# Altium project Weather_Project.PrjPcb
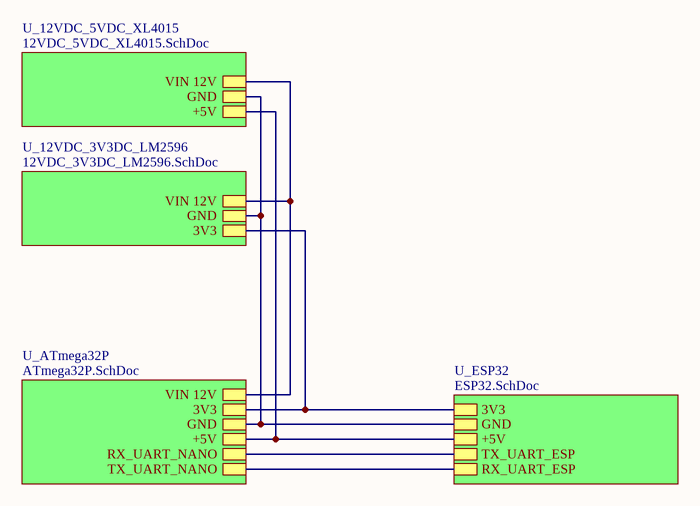
[diagram p0: Merg_project.SchDoc]
4 sheets, 53 parts. Net scope: hierarchical (ports join the sheet entries above them; power ports are global).
Board file: Weather_SIM_PCB.PcbDoc
Sheets:
  Merg_project.SchDoc
    U_12VDC_3V3DC_LM2596 = 12VDC_3V3DC_LM2596.SchDoc
    U_12VDC_5VDC_XL4015 = 12VDC_5VDC_XL4015.SchDoc
    U_ESP32 = ESP32.SchDoc

## Sheet Merg_project.SchDoc
size A; SheetNumber: 1; SheetTotal: 5

### Sub-sheets
U_12VDC_3V3DC_LM2596 = 12VDC_3V3DC_LM2596.SchDoc: 3V3, GND, VIN 12V
U_12VDC_5VDC_XL4015 = 12VDC_5VDC_XL4015.SchDoc: +5V, GND, VIN 12V
U_ATmega32P = ATmega32P.SchDoc (file not in this document): TX_UART_NANO, RX_UART_NANO, +5V, GND, 3V3, VIN 12V
U_ESP32 = ESP32.SchDoc: 3V3, GND, +5V, TX_UART_ESP, RX_UART_ESP

### Nets
3V3: sheet U_12VDC_3V3DC_LM2596/3V3, sheet U_ATmega32P/3V3, sheet U_ESP32/3V3
+5V: sheet U_12VDC_5VDC_XL4015/+5V, sheet U_ATmega32P/+5V, sheet U_ESP32/+5V
GND: sheet U_12VDC_3V3DC_LM2596/GND, sheet U_12VDC_5VDC_XL4015/GND, sheet U_ATmega32P/GND, sheet U_ESP32/GND
IO21: sheet U_ATmega32P/TX_UART_NANO, sheet U_ESP32/RX_UART_ESP
IO22: sheet U_ATmega32P/RX_UART_NANO, sheet U_ESP32/TX_UART_ESP
VIN: sheet U_12VDC_3V3DC_LM2596/VIN 12V, sheet U_12VDC_5VDC_XL4015/VIN 12V, sheet U_ATmega32P/VIN 12V

## Sheet 12VDC_3V3DC_LM2596.SchDoc
size 381 x 241 mm; SheetNumber: 3; SheetTotal: 5
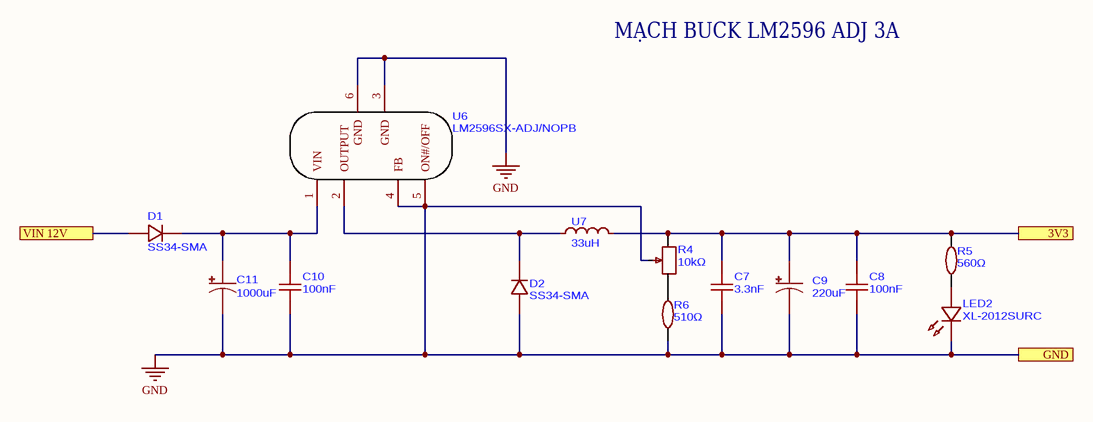
[diagram p1: 12VDC_3V3DC_LM2596.SchDoc]

### Parts
C7  3.3nF  [C0805]
C8  100nF  [C0805]
C9  220uF  [CAP-SMD_BD10.0-L10.3-W10.3-LS11.0-R-RD]
C10  100nF  [C0805]
C11  1000uF  [CAP-SMD_BD10.0-L10.3-W10.3-LS11.0-R-RD]
D1  SS34-SMA  [SMA_L4.3-W2.6-LS5.2-RD]
D2  SS34-SMA  [SMA_L4.3-W2.6-LS5.2-RD]
LED2  XL-2012SURC  [LED0805-RD_RED]
R4  10kΩ  [RES-ADJ-TH_3296W]
R5  560Ω  [R0805]
R6  510Ω  [R0805]
U6  LM2596SX-ADJ/NOPB  [TO-263-5_L10.2-W8.9-P1.70-TL]
U7  33uH  [IND-SMD_L10.0-W10.0_744066100]

### Ports
3V3 (see Merg_project[2B], ATmega32P[1A], ESP32[1A]), GND (see Merg_project[2B], 12VDC_5VDC_XL4015[4C], ATmega32P[1A], ESP32[1A]), VIN 12V (see Merg_project[2B], 12VDC_5VDC_XL4015[1B], ATmega32P[6D])

### Nets
3V3: C7.2 C8.2 C9.1 R4.1 R5.2 U7.2 ; port 3V3
GND: C7.1 C8.1 C9.2 C10.1 C11.2 D2.2 LED2.1(K) R4.2 R6.1 U6.3(GND) U6.4(FB) U6.5(ON#/OFF) U6.6(GND) ; port GND
VIN: D1.2 ; port VIN 12V
NetC10_2: C10.2 C11.1 D1.1 U6.1(VIN)
NetD2_1: D2.1 U6.2(OUTPUT) U7.1
NetLED2_2: LED2.2(A) R5.1
NetR4_3: R4.3 R6.2

### Notes on the sheet
- MẠCH BUCK LM2596 ADJ 3A

### Library data of the parts
C7 C8 C10 = CC0805KRX7R9BB104
C9 C11 = VEJ102M1ATR-1010
R4 = 3296W-1-103_C330432
R5 R6 = RC0805FR-071KL
U7 = SRU1038-330Y

## Sheet 12VDC_5VDC_XL4015.SchDoc
size A; SheetNumber: 2; SheetTotal: 5
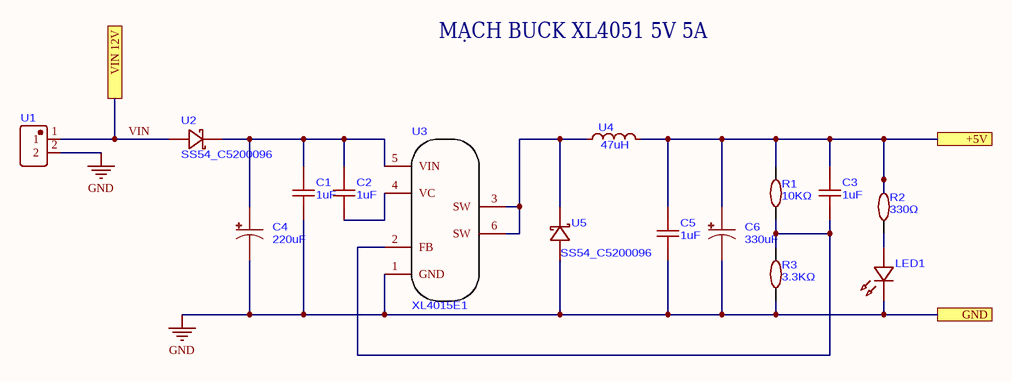
[diagram p2: 12VDC_5VDC_XL4015.SchDoc]

### Parts
C1  1uF  [C0805]
C2  1uF  [C0805]
C3  1uF  [C0805]
C4  220uF  [CAP-SMD_BD10.0-L10.3-W10.3-LS11.0-R-RD]
C5  1uF  [C0805]
C6  330uF  [CAP-SMD_BD10.0-L10.3-W10.3-LS11.0-R-RD]
LED1  XL-2012SURC  [LED0805-RD_RED]  (value not drawn)
R1  10KΩ  [R0805]
R2  330Ω  [R0805]
R3  3.3KΩ  [R0805]
U1  WJ500V-5.08-2P-13-00A  [CONN-TH_2P-P5.08-WJ500V-5.08-2P]  (value not drawn)
U2  SS54_C5200096  [SMB_L4.3-W3.6-LS5.4-RD]
U3  XL4015E1  [TO-263-5_L10.2-W8.9-P1.70-TL]
U4  47uH  [IND-TH_L14.0-W6.5-P8.00-D0.6]
U5  SS54_C5200096  [SMB_L4.3-W3.6-LS5.4-RD]

### Ports
+5V (see Merg_project[2A], ATmega32P[1A], ESP32[1B]), GND (see Merg_project[2A], 12VDC_3V3DC_LM2596[5C], ATmega32P[1A], ESP32[1A]), VIN 12V (see Merg_project[2A], 12VDC_3V3DC_LM2596[2B], ATmega32P[6D])

### Nets
+5V: C3.2 C5.2 C6.1 R1.2 R2.2 U4.2 ; port +5V
GND: C1.1 C4.2 C5.1 C6.2 LED1.1(K) R3.1 U1.2 U3.1(GND) U5.2 ; port GND
VIN: U1.1 U2.2 ; port VIN 12V
NetC1_2: C1.2 C2.2 C4.1 U2.1 U3.5(VIN)
NetC2_1: C2.1 U3.4(VC)
NetC3_1: C3.1 R1.1 R3.2 U3.2(FB)
NetLED1_2: LED1.2(A) R2.1
NetU3_3: U3.3(SW) U3.6(SW) U4.1 U5.1

### Notes on the sheet
- MẠCH BUCK XL4051 5V 5A

### Library data of the parts
C1-C3 C5 = CC0805KRX7R9BB104
C4 C6 = VEJ102M1ATR-1010
R1-R3 = RC0805FR-071KL
U4 = XR050125T680M-V

## Sheet ESP32.SchDoc
size 317 x 241 mm; SheetNumber: 5; SheetTotal: 5
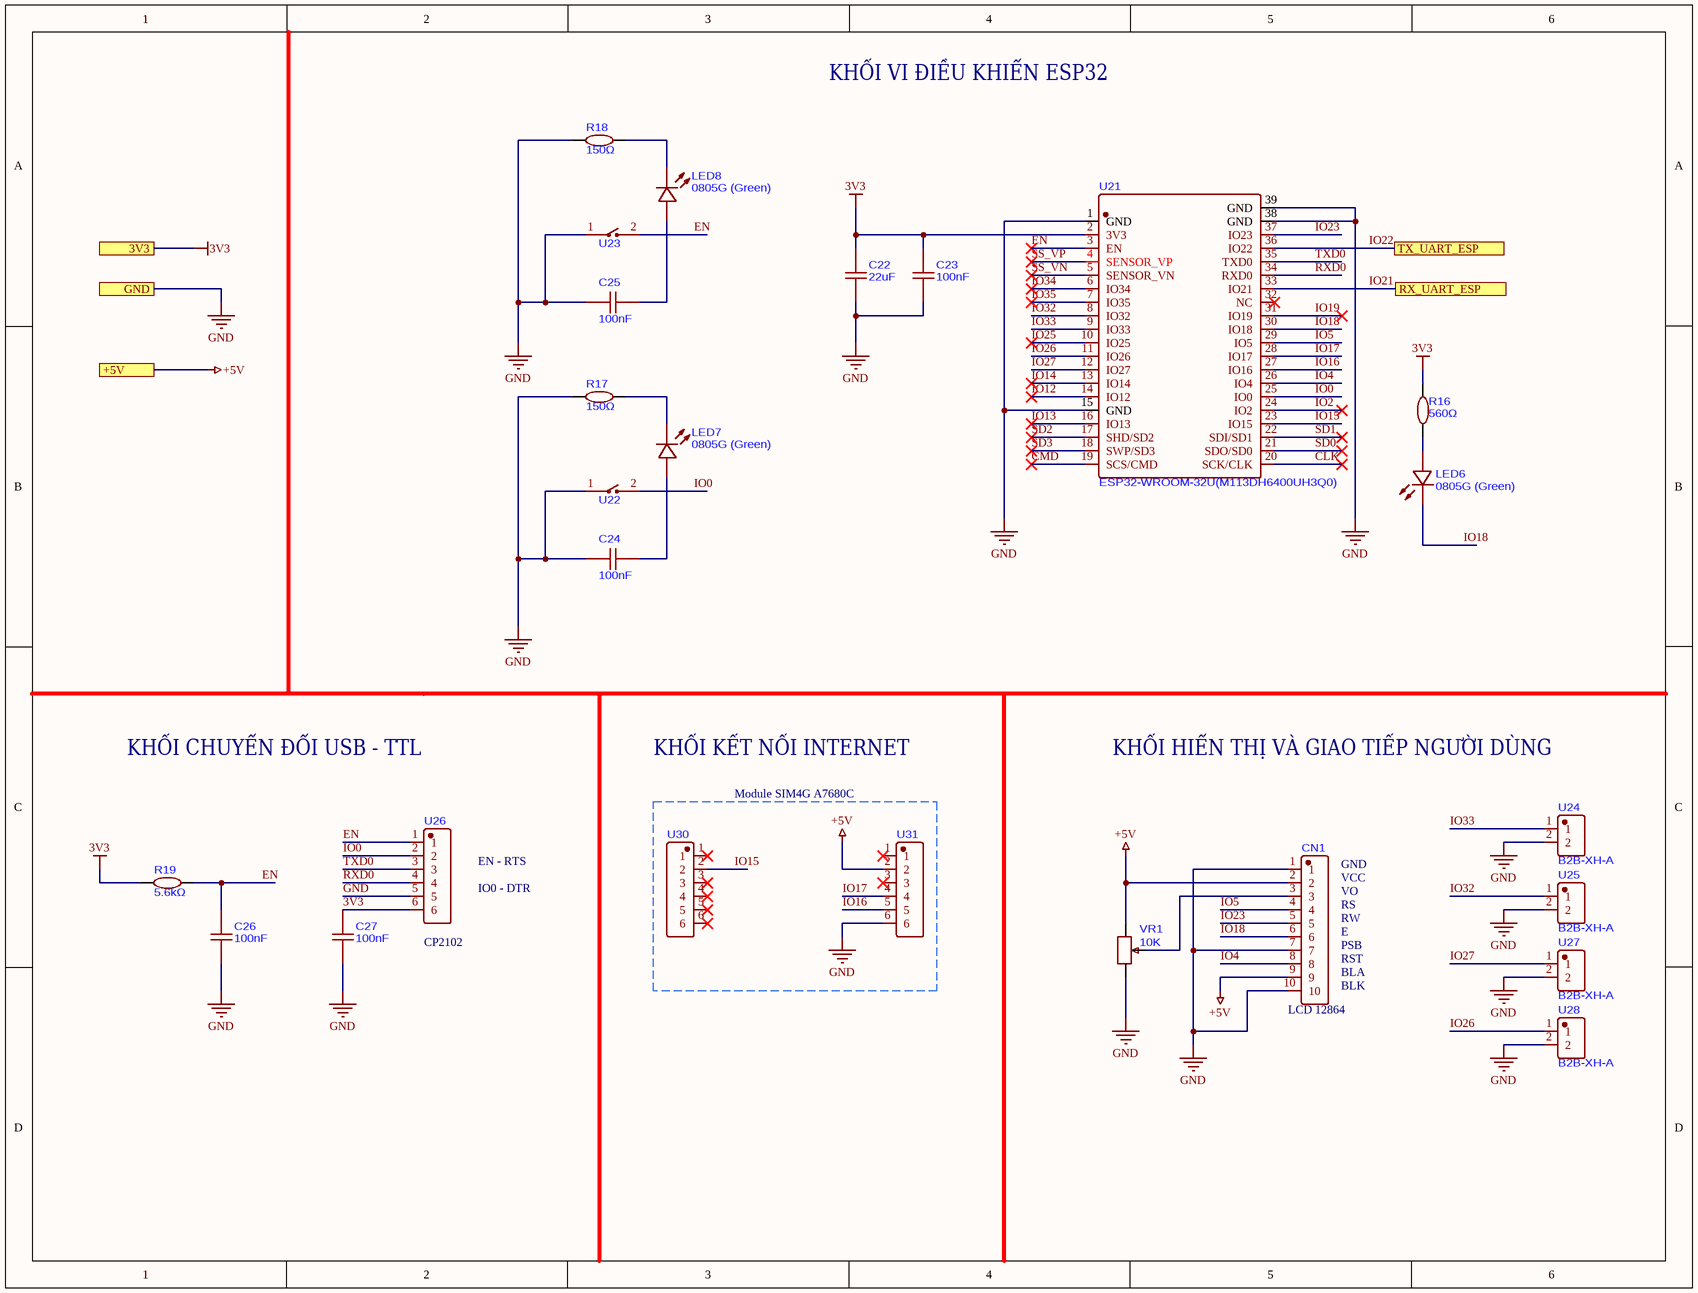
[diagram p3: ESP32.SchDoc]

### Parts
C22  22uF  [C0805]
C23  100nF  [C0805]
C24  100nF  [C0805]
C25  100nF  [C0805]
C26  100nF  [C0805]
C27  100nF  [C0805]
CN1  ZX-XH2.54-10PZZ-GW  [CONN-TH_10P-P2.50_ZX-XH2.54-10PZZ-GW]  (value not drawn)
LED6  0805G (Green)  [LED0805-R-RD]
LED7  0805G (Green)  [LED0805-R-RD]
LED8  0805G (Green)  [LED0805-R-RD]
R16  560Ω  [R0805]
R17  150Ω  [R0805]
R18  150Ω  [R0805]
R19  5.6kΩ  [R0805]
U21  ESP32-WROOM-32U(M113DH6400UH3Q0)  [WIFI-SMD_ESP32-WROOM-32UE-A]
U22  轻触按键 3X6X2.5MM  [SW-SMD_L6.1-W3.7-LS8.0]  (value not drawn)
U23  轻触按键 3X6X2.5MM  [SW-SMD_L6.1-W3.7-LS8.0]  (value not drawn)
U24  B2B-XH-A  [CONN-TH_XH-2A]
U25  B2B-XH-A  [CONN-TH_XH-2A]
U26  HB-PH3-25416PB2GOP  [HDR-TH_6P-P2.54-V-M]  (value not drawn)
U27  B2B-XH-A  [CONN-TH_XH-2A]
U28  B2B-XH-A  [CONN-TH_XH-2A]
U30  HB-PH3-25416PB2GOP  [HDR-TH_6P-P2.54-V-M]  (value not drawn)
U31  HB-PH3-25416PB2GOP  [HDR-TH_6P-P2.54-V-M]  (value not drawn)
VR1  10K  [RES-ADJ-TH_3P-L9.5-W9.5-P2.50-3386P-1-103_C48601064]

### Blocks framed on the sheet
Module SIM4G A7680C: U30 U31

### Ports
3V3 (see Merg_project[2B], 12VDC_3V3DC_LM2596[5B], ATmega32P[1A]), +5V (see Merg_project[2C], 12VDC_5VDC_XL4015[4B], ATmega32P[1A]), GND (see Merg_project[2C], 12VDC_3V3DC_LM2596[5C], 12VDC_5VDC_XL4015[4C], ATmega32P[1A]), RX_UART_ESP (see Merg_project[2C]), TX_UART_ESP (see Merg_project[2C])

### Nets
3V3: C22.2 C23.2 C27.2 R16.2 R19.1 U21.2(3V3) U26.6 ; port 3V3
+5V: CN1.2 CN1.9 U31.2 VR1.1 ; port +5V
GND: C22.1 C23.1 C24.2 C25.2 C26.1 C27.1 CN1.1 CN1.7 CN1.10 R17.2 R18.2 U21.1(GND) U21.15(GND) U21.38(GND) U21.39(GND) U22.1 U23.1 U24.2 U25.2 U26.5 U27.2 U28.2 U31.6 VR1.3 ; port GND
CLK: U21.20(SCK/CLK)
CMD: U21.19(SCS/CMD)
EN: C26.2 R19.2 U21.3(EN) U23.2 U26.1
IO0: U21.25(IO0) U22.2 U26.2
IO2: U21.24(IO2)
IO4: CN1.8 U21.26(IO4)
IO5: CN1.4 U21.29(IO5)
IO12: U21.14(IO12)
IO13: U21.16(IO13)
IO14: U21.13(IO14)
IO15: U21.23(IO15) U30.2
IO16: U21.27(IO16) U31.5
IO17: U21.28(IO17) U31.4
IO18: CN1.6 LED6.2(K) U21.30(IO18)
IO19: U21.31(IO19)
IO21: U21.33(IO21) ; port RX_UART_ESP
IO22: U21.36(IO22) ; port TX_UART_ESP
IO23: CN1.5 U21.37(IO23)
IO25: U21.10(IO25)
IO26: U21.11(IO26) U28.1
IO27: U21.12(IO27) U27.1
IO32: U21.8(IO32) U25.1
IO33: U21.9(IO33) U24.1
IO34: U21.6(IO34)
IO35: U21.7(IO35)
RXD0: U21.34(RXD0) U26.4
SD0: U21.21(SDO/SD0)
SD1: U21.22(SDI/SD1)
SD2: U21.17(SHD/SD2)
SD3: U21.18(SWP/SD3)
SS_VN: U21.5(SENSOR_VN)
SS_VP: U21.4(SENSOR_VP)
TXD0: U21.35(TXD0) U26.3
NetC24_1: C24.1 LED7.1(A)
NetC25_1: C25.1 LED8.1(A)
NetCN1_3: CN1.3 VR1.2
NetLED6_1: LED6.1(A) R16.1
NetLED7_2: LED7.2(K) R17.1
NetLED8_2: LED8.2(K) R18.1

Not connected (* = marked no-connect by the designer): U21 32(NC)*; U30 1* 3* 4* 5* 6*; U31 1* 3*

### Notes on the sheet
- KHỐI VI ĐIỀU KHIỂN ESP32
- KHỐI CHUYỂN ĐỔI USB - TTL
- KHỐI KẾT NỐI INTERNET
- KHỐI HIỂN THỊ VÀ GIAO TIẾP NGƯỜI DÙNG
- EN - RTS
- IO0 - DTR
- (near CN1) GND
- (near CN1) VCC
- (near CN1) VO
- (near CN1) RS
- (near U26) CP2102
- (near CN1) RW
- (near CN1) E
- (near CN1) PSB
- (near CN1) RST
- (near CN1) BLA
- (near CN1) LCD 12864
- (near CN1) BLK

### Library data of the parts
C22-C27 = CC0805KRX7R9BB104
R16 = 0805W8F5101T5E
R17 R18 = RC0805FR-07330RL
R19 = RC0805FR-075K6L
VR1 = 3386P-1-103_C48601064

## Nets that join several sheets
3V3: 12VDC_3V3DC_LM2596 (6 pins), ESP32 (7 pins)
+5V: 12VDC_5VDC_XL4015 (6 pins), ESP32 (CN1.2 CN1.9 U31.2 VR1.1)
GND: 12VDC_3V3DC_LM2596 (13 pins), 12VDC_5VDC_XL4015 (9 pins), ESP32 (24 pins)
VIN: 12VDC_3V3DC_LM2596 (D1.2), 12VDC_5VDC_XL4015 (U1.1 U2.2)